# EAGLE design Threeno DB28 Tx Rev1 (EAGLE 9.6.2)
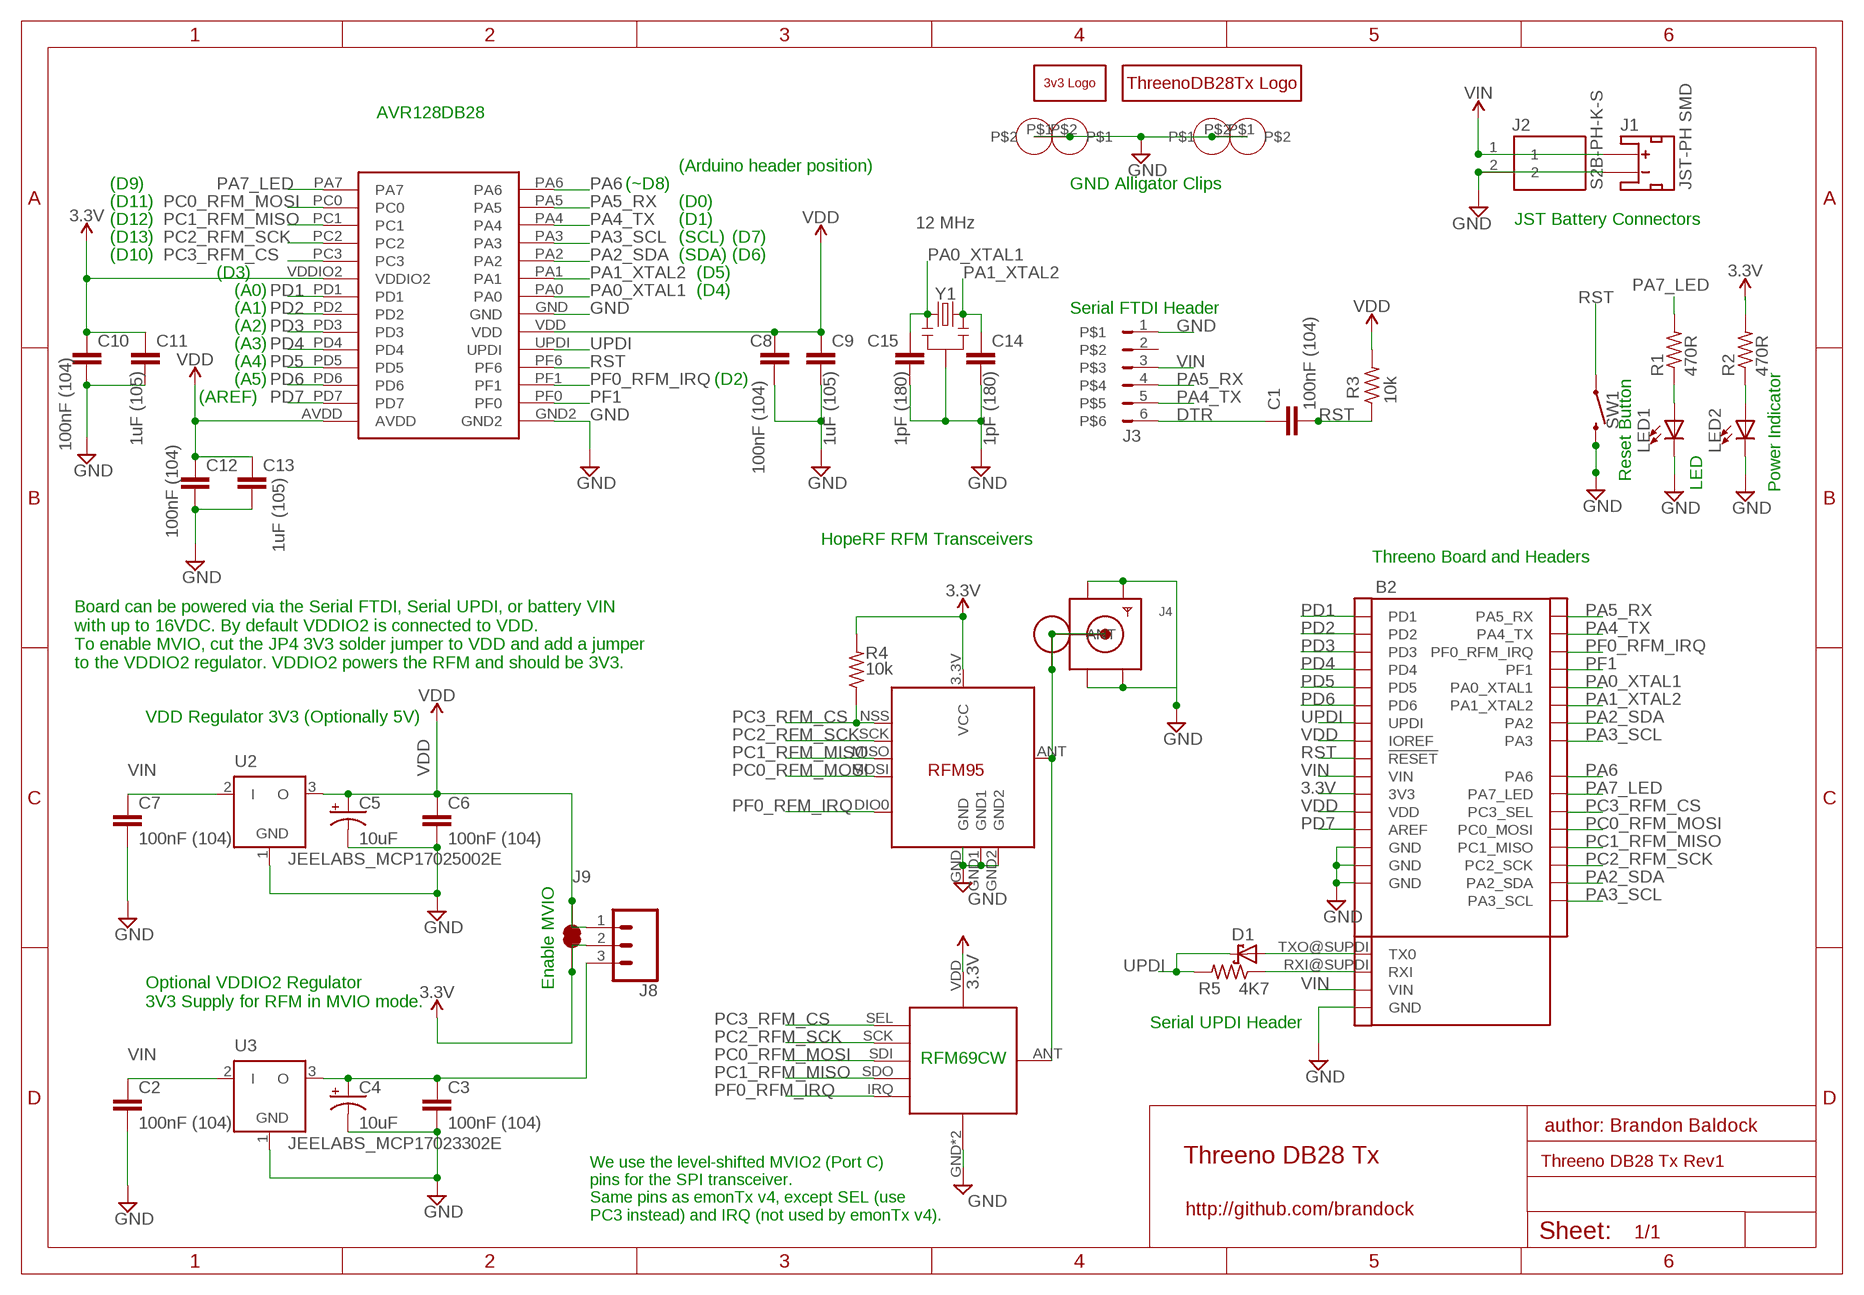
[diagram p0: schematic, sheet 1]

## Parts
B1  3VTHREENO_BOTTOM_SILK  [3VTHREENO_BOTTOM_SILK]
B2  THREENO_DB28_TX_BOARD_V1.1  [THREENO_DB28_TX_BOARD_V1.1]
B3  THREENO_DB28_TX_LOGO  [THREENO_DB28_TX_LOGO]
C1  100nF (104)  C-EU025-024X044-NO_MIDDLE_SILK  [C025-024X044-NO-MIDDLE-SILK]
C2  100nF (104)  C-EU025-024X044-NO_MIDDLE_SILK  [C025-024X044-NO-MIDDLE-SILK]
C3  100nF (104)  C-EU025-024X044-NO_MIDDLE_SILK  [C025-024X044-NO-MIDDLE-SILK]
C4  10uF  CPOL-USE1.8-4  [E1,8-4]
C5  10uF  CPOL-USE1.8-4  [E1,8-4]
C6  100nF (104)  C-EU025-024X044-NO_MIDDLE_SILK  [C025-024X044-NO-MIDDLE-SILK]
C7  100nF (104)  C-EU025-024X044-NO_MIDDLE_SILK  [C025-024X044-NO-MIDDLE-SILK]
C8  100nF (104)  C-EU025-024X044-NO_MIDDLE_SILK  [C025-024X044-NO-MIDDLE-SILK]
C9  1uF (105)  C-EU025-024X044-NO_MIDDLE_SILK  [C025-024X044-NO-MIDDLE-SILK]
C10  100nF (104)  C-EU025-024X044-NO_MIDDLE_SILK  [C025-024X044-NO-MIDDLE-SILK]
C11  1uF (105)  C-EU025-024X044-NO_MIDDLE_SILK  [C025-024X044-NO-MIDDLE-SILK]
C12  100nF (104)  C-EU025-024X044-NO_MIDDLE_SILK  [C025-024X044-NO-MIDDLE-SILK]
C13  1uF (105)  C-EU025-024X044-NO_MIDDLE_SILK  [C025-024X044-NO-MIDDLE-SILK]
C14  1pF (180)  C-EU025-024X044-NO_MIDDLE_SILK  [C025-024X044-NO-MIDDLE-SILK]
C15  1pF (180)  C-EU025-024X044-NO_MIDDLE_SILK  [C025-024X044-NO-MIDDLE-SILK]
D1  DIODE SCHOTTKY 30V 200MA DO35  SCHOTTKY-DIODEDO41-7  [DO41-7]
J1  JST_2MM_MALE  [JST-2-SMD]
J2  S2B-PH-K-S  [S2BPHKS]
J3  FTDI  [FTDI_ROUND_HEADER_SILK]
J4  SMACONNECTOR_EDGE  [SMA_EDGELAUNCH]
J5  RFM12B_ANTENNA  [RFM12B-ANTENNA]
J6  ALLIGATORCLIP-WIRELOOP  [ALLIGATORCLIP-WIRELOOP]
J7  ALLIGATORCLIP-WIRELOOP  [ALLIGATORCLIP-WIRELOOP]
J8  455-1750-1-ND  CONN_03  [1X03]
J9  JUMPER-SMT_2_NC_TRACE_24_MIL_NO-SILK  [SMT-JUMPER_2_NC_TRACE_NO-SILK_24_MIL]
LED1  LED-BRANDOCK3MM  [LED3MM-BRANDOCK]
LED2  LED-BRANDOCK3MM  [LED3MM-BRANDOCK]
R1  470R  R-US_0204/7  [0204/7]
R2  470R  R-US_0204/7  [0204/7]
R3  10k  R-US_0204/7  [0204/7]
R4  10k  R-US_0204/7  [0204/7]
R5  4K7  R-US_0204/7  [0204/7]
RF1  RFM12B_MINPADS  [RFM12B-MINPADS]
RF2  RFM95LONGER  [RFM95_LONGER]
SW1  MOMENTARY-SWITCH-SPST-PTH-6.0MM  [TACTILE_SWITCH_PTH_6.0MM]
U1  AVR128DB28  [DIL28-3]
U2  JEELABS_MCP17025002E  [JEELABS_TO92]
U3  JEELABS_MCP17023302E  [JEELABS_TO92]
Y1  12 MHz  CRYSTAL-OR-RESONATOR  [HC49US-OR-RESONATOR]

## Nets
3.3V: B2.3.3V(3V3) C10.1 C11.1 J8.2 J9.2 R2.2 R4.2 RF1.VDD RF2.3.3V(VCC) U1.VDDIO2
DTR: C1.1 J3.6
GND: B2.GND@1(GND) B2.GND@2(GND) B2.GND@3(GND) B2.GND@SUPDI(GND) C2.2 C3.2 C4.- C5.- C6.2 C7.2 C8.2 C9.2 C10.2 C11.2 C12.2 C13.2 C14.2 C15.2 J1.1(-) J2.2 J3.1 J4.GND@1(GND4) J4.GND@2(GND3) J4.GND@3(GND2) J4.GND@4(GND1) J6.P$1 J6.P$2 J7.P$1 J7.P$2 LED1.K(C) LED2.K(C) RF1.GND RF1.GND2(GND) RF2.GND RF2.GND1 RF2.GND2 SW1.3 U1.GND U1.GND2 U2.1(GND) U3.1(GND) Y1.2
N$2: LED2.A R2.1
N$3: J4.P(ANT) J5.P$1 RF1.ANT RF2.ANT
N$5: B2.RXI@SUPDI(RXI) R5.1
N$6: B2.TXO@SUPDI(TX0) D1.A
N$7: C3.1 C4.+ J8.3 U3.3(O)
N$14: LED1.A R1.1
PA0_XTAL1: B2.PA0(PA0_XTAL1) C15.1 U1.PA0 Y1.1
PA1_XTAL2: B2.PA1(PA1_XTAL2) C14.1 U1.PA1 Y1.3
PA2_SDA: B2.PA2 B2.PA2|SDA(PA2_SDA) U1.PA2
PA3_SCL: B2.PA3 B2.PA3|SCL(PA3_SCL) U1.PA3
PA4_TX: B2.PA4|TX(PA4_TX) J3.5 U1.PA4
PA5_RX: B2.PA5|RX(PA5_RX) J3.4 U1.PA5
PA6: B2.PA6 U1.PA6
PA7_LED: B2.PA7(PA7_LED) R1.2 U1.PA7
PC0_RFM_MOSI: B2.PC0(PC0_MOSI) RF1.SDI(SDI/MOSI) RF2.MOSI U1.PC0
PC1_RFM_MISO: B2.PC1(PC1_MISO) RF1.SDO(SDO/MISO) RF2.MISO U1.PC1
PC2_RFM_SCK: B2.PC2(PC2_SCK) RF1.SCK RF2.SCK U1.PC2
PC3_RFM_CS: B2.PC3(PC3_SEL) R4.1 RF1.SEL RF2.NSS(SEL) U1.PC3
PD1: B2.PD1|A0(PD1) U1.PD1
PD2: B2.PD2|A1(PD2) U1.PD2
PD3: B2.PD3|A2(PD3) U1.PD3
PD4: B2.PD4|A3(PD4) U1.PD4
PD5: B2.PD5|A4(PD5) U1.PD5
PD6: B2.PD6|A5(PD6) U1.PD6
PD7: B2.PD7(AREF) U1.PD7
PF0_RFM_IRQ: B2.PF0(PF0_RFM_IRQ) RF1.IRQ RF2.DIO0 U1.PF1
PF1: B2.PF1 U1.PF0
RST: B2.RESET@1(!RESET!) C1.2 R3.1 SW1.1 U1.PF6
UPDI: B2.NC(UPDI) D1.C R5.2 U1.UPDI
VDD: B2.VDD B2.VDD|IOREF(IOREF) C5.+ C6.1 C8.1 C9.1 C12.1 C13.1 J8.1 J9.1 R3.2 U1.AVDD U1.VDD U2.3(O)
VIN: B2.VIN B2.VIN@SUPDI(VIN) C2.1 C7.1 J1.2(+) J2.1 J3.3 U2.2(I) U3.2(I)
Unconnected: J1.NC1(PAD1) J1.NC2(PAD2) J3.2

## Notes on the sheet
- AVR128DB28
- (Arduino header position)
- (D9) | (~D8) | GND Alligator Clips | S2B-PH-K-S | JST-PH SMD
- (D11) | (D0) | Optional Crystal
- (D12) | (D1) | JST Battery Connectors
- (D13) | (SCL) | (D7)
- (D10) | (SDA) | (D6)
- (D3) | (D5)
- (A0) | (D4)
- (A1) | Serial FTDI Header
- (A2)
- (A3)
- (A4)
- (A5) | (D2)
- (AREF)
- Auto-reset cap is used instead of filtering
  cap from 4.3 of AVR128DB datasheet.
- Reset Button
- LED | Power Indicator
- HopeRF RFM Transceivers
- Threeno Board and Headers
- Board can be powered via the Serial FTDI, Serial UPDI, or battery VIN
  with up to 16VDC. By default VDDIO2 is connected to VDD.
  To enable MVIO, cut the JP4 3V3 solder jumper to VDD and add a jumper
  to the VDDIO2 regulator. VDDIO2 powers the RFM and should be 3V3.
- VDD Regulator 3V3 (Optionally 5V)
- Enable MVIO
- Optional VDDIO2 Regulator
  3V3 Supply for RFM in MVIO mode.
- Serial UPDI Header
- RFM69CW
- author: Brandon Baldock
- Threeno DB28 Tx
- http://github.com/brandock
- We use the level-shifted MVIO2 (Port C)
  pins for the SPI transceiver.
  Same pins as emonTx v4, except SEL (use
  PC3 instead) and IRQ (not used by emonTx v4).

## Library data of the parts
B1 = 3VThreeno:3VTHREENO_BOTTOM_SILK: Arduino R3 Footprint with SPI header Arduino Uno R3 Compatible Footprint. Matches PCB size of the original board. SparkFun Products: SAMD21 Dev Breakout <https://www.sparkfun.com/products/13672> RedBoard <https://www.sparkfun.com/products/12757> R3 Stackable Headers <https://www.sparkfun.com/products/11417>
B2 = 3VThreeno:THREENO_DB28_TX_BOARD_V1.1: Arduino R3 Footprint with SPI header Arduino Uno R3 Compatible Footprint. Matches PCB size of the original board. SparkFun Products: SAMD21 Dev Breakout <https://www.sparkfun.com/products/13672> RedBoard <https://www.sparkfun.com/products/12757> R3 Stackable Headers <https://www.sparkfun.com/products/11417>
B3 = 3VThreeno:THREENO_DB28_TX_LOGO: Arduino R3 Footprint with SPI header Arduino Uno R3 Compatible Footprint. Matches PCB size of the original board. SparkFun Products: SAMD21 Dev Breakout <https://www.sparkfun.com/products/13672> RedBoard <https://www.sparkfun.com/products/12757> R3 Stackable Headers <https://www.sparkfun.com/products/11417>
C1-C3 C6-C15 = rcl-brandock:C-EU: CAPACITOR, European symbol
C4 C5 = rcl:CPOL-US: POLARIZED CAPACITOR, American symbol; SPICEPREFIX: C
D1 = adafruit:SCHOTTKY-DIODE: Schottky Diode
J1 = SparkFun-Connectors:JST_2MM_MALE: JST 2MM MALE RA CONNECTOR Two pin, compact surface mount connector. Commonly used as a battery input connection point. We really like the solid locking feeling and high current rating on these small connectors. We use these all the time as battery connectors. Mates to single-cell LiPo batteries. Here is the connector we sell at SparkFun: JST Right Angle Connector - White <https://www.sparkfun.com/products/8612> (PRT-08612) Datasheet <http://www.sparkfun.com/datasheets/Prototyping/Connectors/JST-Horizontal.pdf> It was used on these SparkFun products: SparkFun MOSFET Power Controller <https://www.sparkfun.com/products/11214> (PRT-11214) SparkFun Battery Babysitter - LiPo Battery Manager <https://www.sparkfun.com/products/13777> (PRT-13777) And many, many others that required a lipo battery connection.; PROD_ID: CONN-11443; SF_ID: PRT-08612
J2 = JST PH Thru Hole S2B-PH-K-S:S2B-PH-K-S: CONN HEADER R/A 2POS 2MM Source: Datasheet <https://media.digikey.com/pdf/Data Sheets/JST PDFs/PH Series.pdf>; DESCRIPTION: CONN HEADER R/A 2POS 2MM; HEIGHT: 4.8mm; MANUFACTURER_NAME: JST (JAPAN SOLDERLESS TERMINALS); MANUFACTURER_PART_NUMBER: S2B-PH-K-S
J3 = FTDI:FTDI: JUMPER
J4 = adafruit:SMACONNECTOR: SMA Connector 90° DIP SMA Connector, 50 Ohm (4UConnector: 07259)
J5 = LowPowerLab:RFM12B_ANTENNA
J6 J7 = Alligator Clip:ALLIGATORCLIP-WIRELOOP
J8 = SparkFun-Connectors:CONN_03: Multi connection point. Often used as Generic Header-pin footprint for 0.1 inch spaced/style header connections On any of the 0.1 inch spaced packages, you can populate with these: Break Away Headers - Straight <https://www.sparkfun.com/products/116> (PRT-00116) Break Away Male Headers - Right Angle <https://www.sparkfun.com/products/553> (PRT-00553) Female Headers <https://www.sparkfun.com/products/115> (PRT-00115) Break Away Headers - Machine Pin <https://www.sparkfun.com/products/117> (PRT-00117) Break Away Female Headers - Swiss Machine Pin <https://www.sparkfun.com/products/743> (PRT-00743) Stackable Header - 3 Pin (Female, 0.1") <https://www.sparkfun.com/products/13875> (PRT-13875) For SCREWTERMINALS and SPRING TERMINALS visit here: Screw Terimnals on SparkFun.com <https://www.sparkfun.com/search/results?term=Screw+Terminals> (5mm/3.5mm/2.54mm spacing) This device is also useful as a general connection point to wire up your design to another part of your project. Our various solder wires solder well into these plated through hole pads. Hook-Up Wire - Assortment (Stranded, 22 AWG) <https://www.sparkfun.com/products/11375> (PRT-11375) Hook-Up Wire - Assortment (Solid Core, 22 AWG) <https://www.sparkfun.com/products/11367> (PRT-11367) View the entire wire category on our website here <https://www.sparkfun.com/categories/141> Special notes: Molex polarized connector foot print use with SKU : PRT-08232 with associated crimp pins and housings.; PROD_ID: XXX-00000
J9 = SparkFun-Jumpers:JUMPER-SMT_2_NC_TRACE_24_MIL: Normally closed trace jumper This jumper has a trace between two pads so it's normally closed (NC). Use a razor knife to open the connection. For best results follow the IPC guidelines for cutting traces: Cutout at least 0.063 mm (0.005 in). Remove all loose material to clean up the cut area. Seal the cut with an approved epoxy. Reapply solder to reclose the connection.
LED1 LED2 = adafruit:LED-BRANDOCK: LED OSRAM: - CHIPLED LG R971, LG N971, LY N971, LG Q971, LY Q971, LO R971, LY R971 LH N974, LH R974 LS Q976, LO Q976, LY Q976 LO Q996 - Hyper CHIPLED LW Q18S LB Q993, LB Q99A, LB R99A - SideLED LS A670, LO A670, LY A670, LG A670, LP A670 LB A673, LV A673, LT A673, LW A673 LH A674 LY A675 LS A676, LA A676, LO A676, LY A676, LW A676 LS A679, LY A679, LG A679 - Hyper Micro SIDELED® LS Y876, LA Y876, LO Y876, LY Y876 LT Y87S - SmartLED LW L88C, LW L88S LB L89C, LB L89S, LG L890 LS L89K, LO L89K, LY L89K LS L896, LA L896, LO L896, LY L896 - TOPLED LS T670, LO T670, LY T670, LG T670, LP T670 LSG T670, LSP T670, LSY T670, LOP T670, LYG T670 LG T671, LOG T671, LSG T671 LB T673, LV T673, LT T673, LW T673 LH T674 LS T676, LA T676, LO T676, LY T676, LB T676, LH T676, LSB T676, LW T676 LB T67C, LV T67C, LT T67C, LS T67K, LO T67K, LY T67K, LW E67C LS E67B, LA E67B, LO E67B, LY E67B, LB E67C, LV E67C, LT E67C LW T67C LS T679, LY T679, LG T679 LS T770, LO T770, LY T770, LG T770, LP T770 LB T773, LV T773, LT T773, LW T773 LH T774 LS E675, LA E675, LY E675, LS T675 LS T776, LA T776, LO T776, LY T776, LB T776 LHGB T686 LT T68C, LB T68C - Hyper Mini TOPLED® LB M676 - Mini TOPLED Santana® LG M470 LS M47K, LO M47K, LY M47K Source: http://www.osram.convergy.de/
R1-R5 = rcl:R-US_: RESISTOR, American symbol; SPICEPREFIX: R
RF1 = RFM_MiniPads:RFM12B_MINPADS
RF2 = RFM_MiniPads:RFM95
SW1 = SparkFun-Switches:MOMENTARY-SWITCH-SPST: Momentary Switch (Pushbutton) - SPST Normally-open (NO) SPST momentary switches (buttons, pushbuttons). Variants PTH-12MM - 12mm square, through-hole Momentary Pushbutton Switch - 12mm Square <https://www.sparkfun.com/products/9190> (COM-09190) PTH-6.0MM, PTH-6.0MM-KIT - 6.0mm square, through-hole Mini Pushbutton Switch <https://www.sparkfun.com/products/97> (COM-00097) KIT package intended for soldering kit's - only one side of pads' copper is exposed. PTH-RIGHT-ANGLE-KIT - Right-angle, through-hole Right Angle Tactile Button <https://www.sparkfun.com/products/10791> - Used on SparkFun BigTime Watch Kit <https://www.sparkfun.com/products/11734> SMD-12MM - 12mm square, surface-mount Tactile Button - SMD (12mm) <https://www.sparkfun.com/products/12993> (COM-12993) Used on SparkFun PicoBoard <https://www.sparkfun.com/products/11888> SMD-4.5MM - 4.5mm Square Trackball Switch Used on SparkFun Blackberry Trackballer Breakout <https://www.sparkfun.com/products/13169> SMD-4.6MMX2.8MM - 4.60mm x 2.80mm, surface mount Used on SparkFun SAMD21 Mini Breakout <https://www.sparkfun.com/products/13664> SMD-5.2MM, SMD-5.2-REDUNDANT - 5.2mm square, surface-mount Mini Pushbutton Switch - SMD <https://www.sparkfun.com/products/8720> (COM-08720) Used on Arduino Pro Mini <https://www.sparkfun.com/products/11114> REDUNDANT package connects both switch circuits together SMD-6.0X3.5MM - 6.0 x 3.5mm, surface mount Momentary Reset Switch SMD <https://www.sparkfun.com/products/8229> (COM-08229) SMD-6.2MM-TALL - 6.2mm square, surface mount Tactile Button - SMD (6mm) <https://www.sparkfun.com/products/12992> Used on SparkFun Digital Sandbox <https://www.sparkfun.com/products/12651> SMD-RIGHT-ANGLE - Right-angle, surface mount Used on SparkFun Block for Intel® Edison - Arduino <https://www.sparkfun.com/products/13036>; PROD_ID: SWCH-08441; SF_SKU: COM-00097
U1 = AVR-DB:AVR128DB28
U2 U3 = JeeLib:JEELABS_MCP1702: 200 mA, Low Power Low Dropout Voltage Regulator
Y1 = SparkFun-Clocks-Brandock:CRYSTAL-OR-RESONATOR: Crystals (Generic) These are passive quartz crystals, which can be used as a clock source for a microcontroller. Crystal's are two-terminal devices. They require external "load" capacitors to generate an oscillating signal.

## Net classes
1 power: width 0.381 mm, clearance 0.254 mm

## Board
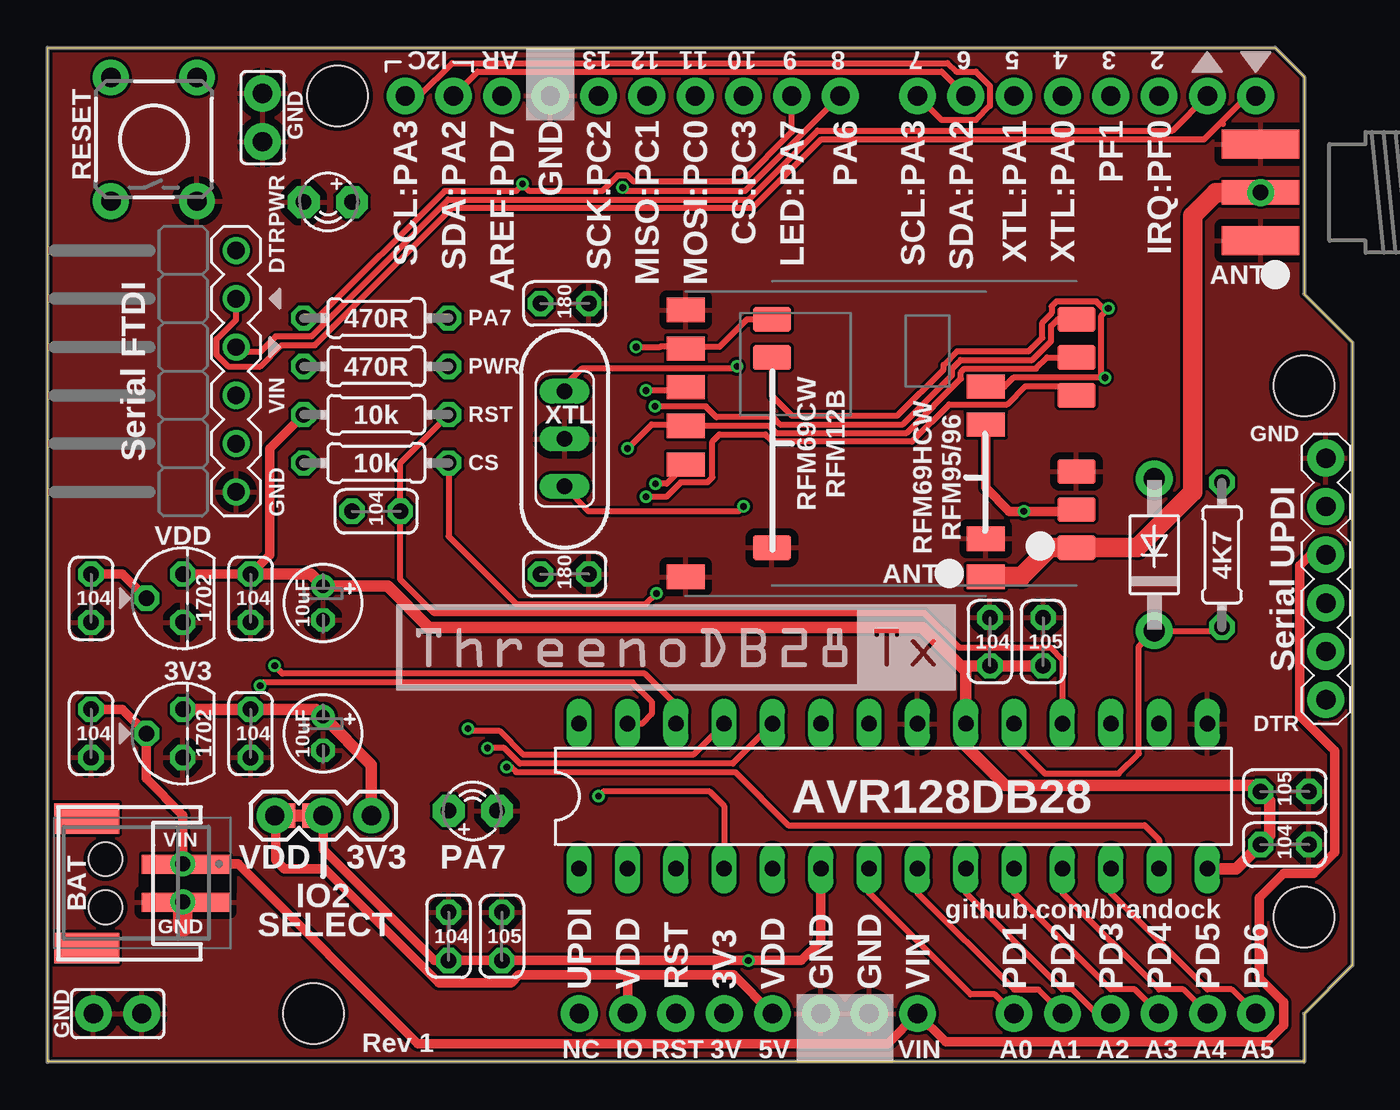
[diagram p1: board, top side]
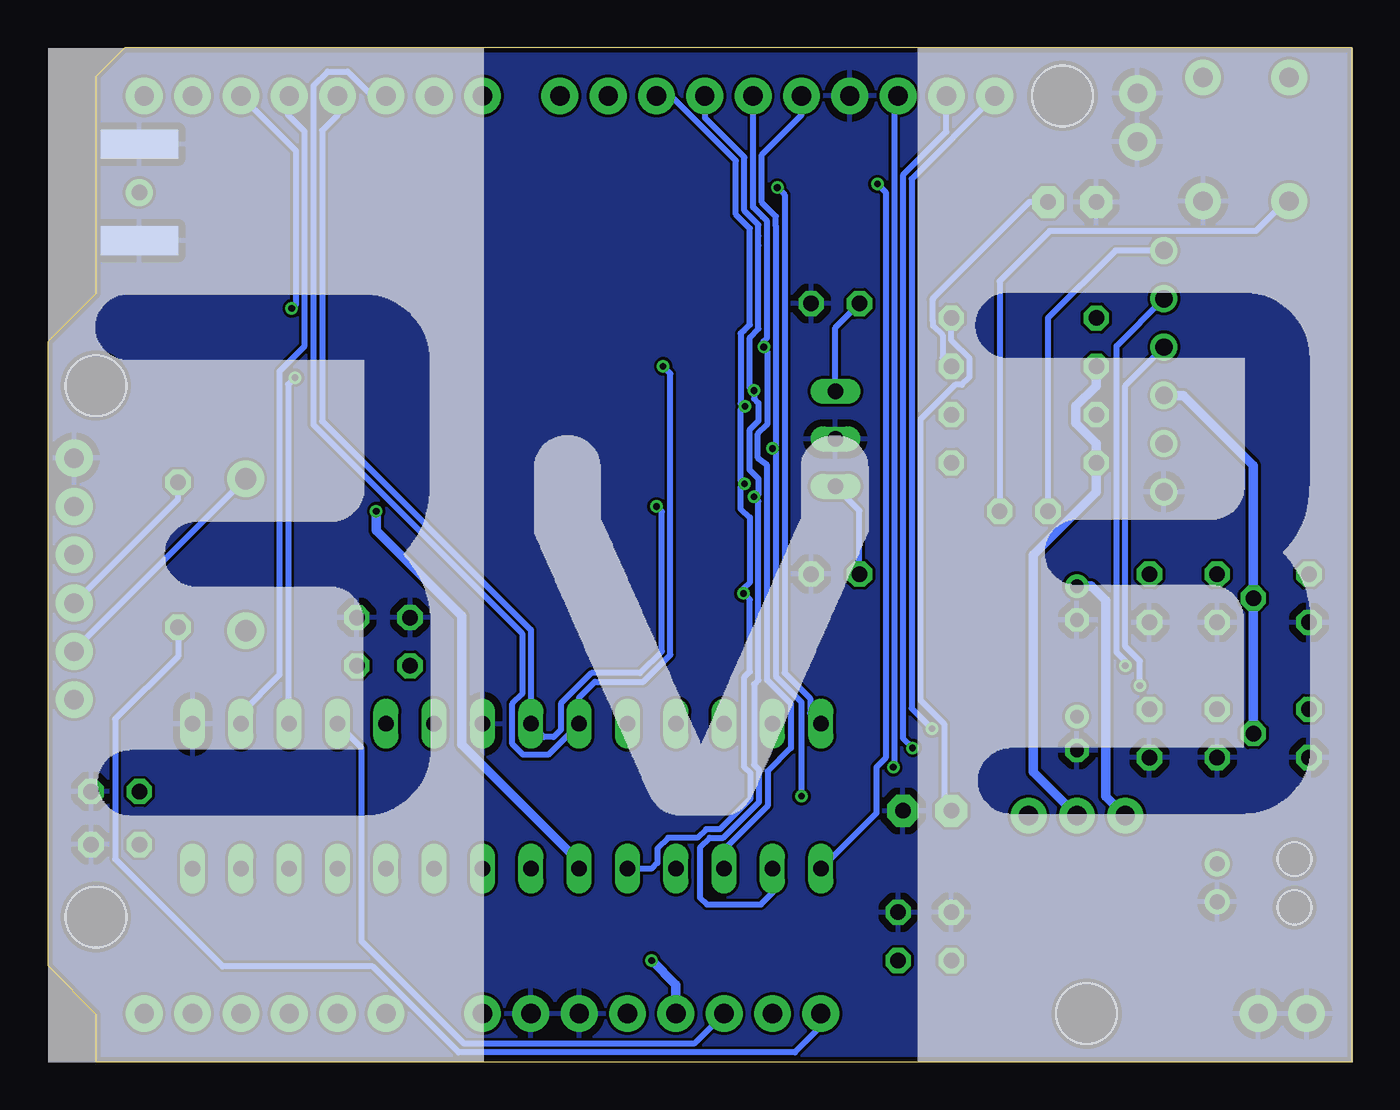
[diagram p2: board, bottom side, seen from below]

Size 68.58 x 53.34 mm. Coordinates in mm from the lower left corner, seen from the top.
Outline: 64.52,53.34 66.04,51.82 66.04,40.39 68.58,37.85 68.58,5.08 66.04,2.54 66.04,0 0,0 0,53.34 64.52,53.34
Copper layers (1*16): Top 0.035mm / dielectric 1.5mm / Bottom 0.035mm
Design rules "ITEADstudio_DRC *": minimum track width 6mil, minimum drill 12mil, track to track 6mil, track to pad 6mil, pad to pad 6mil, via to via 6mil, smd to smd 0mil, copper to edge 10mil, drill to drill 10mil, minimum pad ring 10mil, minimum via ring 6mil, stop-mask expansion 2mil, vias tented up to drill 100mil, thermal gap 15mil
Holes 1.78 mm at 3.05,10.67 3.05,8.13
tRestrict: area 4.8,8.9 to 9.9,9.9

### Footprints (pad centres in the part's own frame; a part is rotated, then mirrored left to right if it is on the bottom)
THREENO_DB28_TX_BOARD_V1.1 = drill 1.016 pad 1.93: 3.3V 2.54,-24.13; CTS@SUPDI 34.163,2.54; DTR@SUPDI 34.163,-7.62; GND@1 7.62,-24.13; GND@2 10.16,-24.13; GND@3 -6.604,24.13; GND@SUPDI 34.163,5.08; NC -5.08,-24.13; PA0 20.32,24.13; PA1 17.78,24.13; PA2 15.24,24.13; PA2|SDA -11.684,24.13; PA3 12.7,24.13; PA3|SCL -14.224,24.13; PA4|TX 30.48,24.13; PA5|RX 27.94,24.13; PA6 8.636,24.13; PA7 6.096,24.13; PC0 1.016,24.13; PC1 -1.524,24.13; PC2 -4.064,24.13; PC3 3.556,24.13; PD1|A0 17.78,-24.13; PD2|A1 20.32,-24.13; PD3|A2 22.86,-24.13; PD4|A3 25.4,-24.13; PD5|A4 27.94,-24.13; PD6|A5 30.48,-24.13; PD7 -9.144,24.13; PF0 25.4,24.13; PF1 22.86,24.13; RESET@1 0,-24.13; RXI@SUPDI 34.163,-2.54; TXO@SUPDI 34.163,-5.08; VDD 5.08,-24.13; VDD|IOREF -2.54,-24.13; VIN 12.7,-24.13; VIN@SUPDI 34.163,0 | hole 3.175: -17.78,24.13; 33.02,8.89; 33.02,-19.05; -19.05,-24.13
C025-024X044-NO-MIDDLE-SILK = drill 0.813 octagon: 1 -1.27,0; 2 1.27,0
E1,8-4 = drill 0.711 pad 1.168: + -0.889,0 | drill 0.711 pad 1.168 octagon: - 0.889,0
DO41-7 = drill 1.118 pad 1.93: A 4,0; C -4,0
JST-2-SMD = smd 1 x 4.6: 1 -1,-3.7; 2 1,-3.7 | smd 1.6 x 3.4: NC1 -3.4,1.5; NC2 3.4,1.5
S2BPHKS = drill 0.8 pad 1.3: 1 0,0; 2 -2,0
FTDI_ROUND_HEADER_SILK = drill 0.914: 1 -2.54,-1.27; 2 0,-1.27; 3 2.54,-1.27; 4 5.08,-1.27; 5 7.62,-1.27; 6 10.16,-1.27
SMA_EDGELAUNCH = smd 4.064 x 1.524: GND@1 2.032,-2.54; GND@2 2.032,2.54 | smd 4.064 x 1.524 bottom: GND@3 2.032,2.54; GND@4 2.032,-2.54 | smd 4.064 x 1.27: P 2.032,0
RFM12B-ANTENNA = drill 0.8 pad 1.422: P$1 0,0
ALLIGATORCLIP-WIRELOOP = drill 1.016 pad 1.93: P$1 -2.54,0; P$2 0,0
1X03 = drill 1.016 pad 1.88: 1 0,0; 2 2.54,0; 3 5.08,0
SMT-JUMPER_2_NC_TRACE_NO-SILK_24_MIL = smd 0.635 x 1.27: 1 -0.508,0; 2 0.508,0
LED3MM-BRANDOCK = drill 0.813 pad 1.676 octagon: A -1.27,0; K 1.27,0
0204/7 = drill 0.813 octagon: 1 -3.81,0; 2 3.81,0
RFM12B-MINPADS = smd 2 x 1.27: ANT 8,-6; GND 8,-2; GND2 -8.002,-6.001; IRQ -8,4; SCK 8,4; SDI 8,2; SDO -8,6; SEL 8,6; VDD 8,-4
RFM95_LONGER = smd 2 x 1.27: 3.3V 7.651,1; ANT 7.651,-7; DIO0 7.651,3; GND 7.651,-5; GND1 -8.107,-7; GND2 -8.107,7.032; MISO -8.107,5; MOSI -8.107,2.968; NSS -8.107,-1.096; SCK -8.107,0.936
TACTILE_SWITCH_PTH_6.0MM = drill 1.016 pad 1.88: 1 -3.251,2.261; 2 3.251,2.261; 3 -3.251,-2.261; 4 3.251,-2.261
DIL28-3 = drill 0.813 long: AVDD -16.51,3.81; GND -1.27,-3.81; GND2 -16.51,-3.81; PA0 1.27,-3.81; PA1 3.81,-3.81; PA2 6.35,-3.81; PA3 8.89,-3.81; PA4 11.43,-3.81; PA5 13.97,-3.81; PA6 16.51,-3.81; PA7 16.51,3.81; PC0 13.97,3.81; PC1 11.43,3.81; PC2 8.89,3.81; PC3 6.35,3.81; PD1 1.27,3.81; PD2 -1.27,3.81; PD3 -3.81,3.81; PD4 -6.35,3.81; PD5 -8.89,3.81; PD6 -11.43,3.81; PD7 -13.97,3.81; PF0 -13.97,-3.81; PF1 -11.43,-3.81; PF6 -8.89,-3.81; UPDI -6.35,-3.81; VDD -3.81,-3.81; VDDIO2 3.81,3.81
JEELABS_TO92 = drill 0.813 octagon: 1 -1.27,0; 2 0,1.905; 3 1.27,0
HC49US-OR-RESONATOR = drill 0.813 long: 1 -2.5,0; 2 0,0; 3 2.5,0

### Placement (x,y rotation side)
B1  33.02,26.67 0 top
B2  33.02,26.67 0 top
B3  34.01,21.49 0 top
C1  17.27,28.96 0 top
C2  2.29,17.27 270 top
C3  10.67,17.27 270 top
C4  14.48,17.27 270 top
C5  14.48,24.13 270 top
C6  10.67,24.38 270 top
C7  2.29,24.38 270 top
C8  49.53,22.1 90 top
C9  52.32,22.1 90 top
C10  23.88,6.6 90 top
C11  21.08,6.6 90 top
C12  65.02,11.43 0 top
C13  65.02,14.22 0 top
C14  27.18,39.88 0 top
C15  27.18,25.65 0 top
D1  58.17,26.67 90 top
J1  3.56,9.4 90 top
J2  7.11,10.41 90 top
J3  8.64,32.51 90 top
J4  65.79,45.72 180 top
J5  63.75,45.72 0 top
J6  11.3,50.93 90 top
J7  2.41,2.54 180 top
J8  11.94,12.95 0 top
J9  13.21,12.95 0 top
LED1  22.35,13.21 0 top
LED2  14.73,45.21 180 top
R1  17.27,39.12 180 top
R2  17.27,36.58 180 top
R3  17.27,34.04 180 top
R4  17.27,31.5 180 top
R5  61.72,26.67 270 top
RF1  46.08,33.05 0 top
RF2  41.66,32.51 0 top
SW1  5.59,48.51 90 top
U1  44.45,13.97 180 top
U2  7.11,24.38 90 top
U3  7.11,17.27 90 top
Y1  27.18,32.77 90 top

### Tracks (layer width: path | path; a pad name or v marks a point on that pad's centre or on a via)
3.3V  (via drill 0.35)
  Top 0.508: U1.VDDIO2 40.64,6.35 39.62,5.33 v36.83,5.33 C10.1 C11.1 20.32,5.33 14.48,11.18 J8.2 J9.2 | RF2.3.3V 49.31,30.2 50.55,28.96 v51.31,28.96 53.99,28.96 RF1.VDD
  Bottom 0.508: v36.83,5.33 35.56,4.06 B2.3.3V | J8.2 16.76,15.24 16.76,26.67 13.46,29.97 R4.2 13.46,32.53 14.53,33.59 14.53,34.48 13.46,35.54 R2.2 | U1.VDDIO2 40.64,10.53 46.82,16.71 46.82,23.45 51.31,27.94 v51.31,28.96
DTR
  Bottom 0.305: J3.6 12.45,42.67 16,39.12 C1.1
GND
  Top 1.016: J1.1 7.11,8.25 7.11,7.11
  pour Top: -7.87,54.61 74.93,54.61 74.93,-1.27 -7.87,-1.27
  pour Bottom: -7.87,54.61 74.93,54.61 74.93,-1.27 -7.87,-1.27
N$2
  Bottom 0.305: LED2.A 16.97,45.21 22.08,40.11 22.05,40.08 22.05,38.96 22.05,38.72 21.54,38.21 21.54,37.03 R2.1
N$3
  Top 1.016: J4.P 61.41,45.72 60.2,44.51 60.2,29.97 57.28,27.05 RF1.ANT 52.7,27.05 51.17,25.52 49.32,25.52 RF2.ANT
N$5
  Bottom 0.305: B2.RXI@SUPDI 61.72,29.59 R5.1
N$6
  Bottom 0.305: D1.A 67.18,21.65 B2.TXO@SUPDI
N$7
  Top 0.61: U3.3 C3.1 14.1,18.54 C4.+ 17.02,15.62 J8.3
N$14
  Bottom 0.305: R1.1 21.08,37.94 20.12,36.98 20.12,36.02 20.52,35.61 20.87,35.61 22.71,33.77 22.71,19.03 21.47,17.79 21.47,13.59 LED1.A
PA0_XTAL1  (via drill 0.35)
  Top 0.305: Y1.1 28.42,28.96 36.32,28.96 v36.58,29.21
  Bottom 0.305: C15.1 25.91,29 Y1.1 | B2.PA0 53.34,49.78 54.15,48.97 54.15,33.69 43.18,22.72 U1.PA0 42.49,17.09 41.98,17.09 41.6,17.46 41.6,18.84 40,20.44 37.45,20.44 36.3,21.6 36.3,28.93 v36.58,29.21
PA1_XTAL2  (via drill 0.35)
  Top 0.305: Y1.3 27.18,35.56 28.07,36.45 36.1,36.45 v36.23,36.58
  Bottom 0.305: Y1.3 27.18,38.61 C14.1 | B2.PA1 51.54,50.8 52.81,52.07 53.87,52.07 54.61,51.33 54.61,33.51 43.64,22.53 43.64,19.35 44.14,18.84 44.14,16.72 43.58,16.15 42.27,16.15 U1.PA1 40.64,19.16 39.81,19.99 37.27,19.99 35.84,21.41 35.84,36.19 v36.23,36.58
PA2_SDA  (via drill 0.35)
  Top 0.305: B2.PA2|SDA 22.61,52.07 46.99,52.07 B2.PA2 | U1.PA2 36.02,15.7 24.82,15.7 24.01,16.51 v23.11,16.51
  Bottom 0.305: B2.PA2|SDA 21.34,48.91 23.62,46.62 23.62,17.02 v23.11,16.51
PA3_SCL  (via drill 0.35)
  Top 0.305: B2.PA3|SCL 19.54,50.8 21.27,52.53 47.29,52.53 47.75,52.07 48.79,52.07 49.53,51.33 49.53,50.27 48.79,49.53 46.99,49.53 B2.PA3 | U1.PA3 33.93,16.15 25.01,16.15 23.77,17.4 22.23,17.4 v22.1,17.53
  Bottom 0.305: B2.PA3|SCL 23.17,46.43 23.17,18.59 v22.1,17.53
PA4_TX  (via drill 0.35)
  Top 0.305: U1.PA4 33.02,18.8 31.4,20.42 12.35,20.42 v11.94,20.83 | J3.5 9.91,39.03 8.89,38.01 8.89,37.17 9.48,36.58 11.18,36.58 12.29,37.69 14.05,37.69 21.24,44.88 37.03,44.88 40.66,48.51 60.78,48.51 61.6,49.33 | 61.77,49.33 61.6,49.33 | 61.6,49.33 63.07,50.8 B2.PA4|TX
  Bottom 0.305: J3.5 12.39,37.64 12.39,21.54 11.94,21.08 v11.94,20.83
PA5_RX  (via drill 0.35)
  Top 0.305: J3.4 10.16,37.34 11.18,37.34 11.99,38.15 13.86,38.15 21.05,45.34 36.84,45.34 40.47,48.97 59.13,48.97 B2.PA5|RX | U1.PA5 31.24,17.78 31.75,18.29 31.75,18.95 30.74,19.96 11.35,19.96 v11.18,19.79
  Bottom 0.305: J3.4 11.94,35.56 11.94,21.84 11.18,21.08 v11.18,19.79
PA6  (via drill 0.35)
  Top 0.305: v30.23,45.97 30.4,45.8 36.66,45.8 B2.PA6
  Bottom 0.305: v30.23,45.97 29.85,45.6 29.85,20.47 28.62,19.24 28.5,19.12 28.5,18.34 U1.PA6
PA7_LED  (via drill 0.35)
  Top 0.305: B2.PA7 39.12,48.91 36.51,46.3 30.8,46.3 30.49,46.61 29.96,46.61 29.16,45.8 25.32,45.8 v24.96,46.16 24.96,46.12 24.64,45.8 20.86,45.8 14.18,39.12 R1.2
  Bottom 0.305: v24.96,46.16 24.54,45.74 24.54,15.98 25.02,15.5 25.02,13.08 U1.PA7
PC0_RFM_MOSI  (via drill 0.35)
  Top 0.305: 54.07,35.05 RF1.SDI 53.85,35.04 53.36,35.53 51.39,35.53 50.43,34.57 47.39,34.57 45.43,32.61 38.11,32.61 37.73,32.99 35.31,32.99 34.94,32.62 34.94,30.74 34.67,30.48 33.27,30.48 32.51,29.72 v31.45,29.72 | RF2.MOSI 33.38,35.31 v31.45,35.31
  Bottom 0.305: U1.PC0 30.48,8.9 31.1,8.28 33.93,8.28 34.29,8.64 34.29,11.28 33.78,11.79 33.06,11.79 31.19,13.65 31.19,15.38 31.45,15.63 31.45,19.86 31.22,20.08 31.22,29.49 v31.45,29.72 31.22,29.84 31.22,30.67 31.7,31.15 31.7,33.22 31.22,33.7 31.22,34.65 31.45,34.88 v31.45,35.31 31.67,35.43 31.67,38.09 31.22,38.55 31.22,42.93 31.22,43.43 31.22,44.02 31.95,44.75 31.95,47.57 34.04,49.65 B2.PC0
PC1_RFM_MISO  (via drill 0.35)
  Top 0.305: 38.08,39.39 RF1.SDO 36.76,39.04 35.31,37.59 33.63,37.59 RF2.MISO 33.45,37.61 32.2,37.61 32.18,37.59 v30.94,37.59
  Bottom 0.305: U1.PC1 33.02,11.18 30.73,13.46 30.73,15.29 29.52,16.51 29.52,18.84 30.76,20.09 30.76,31.39 31.22,31.74 31.24,31.77 31.24,33.03 30.76,33.51 30.76,37.37 v30.94,37.59 30.99,37.85 30.76,38.07 30.76,43.69 | 30.76,43.69 30.76,44.21 31,44.44 31.5,44.94 B2.PC1 | 30.76,43.69
PC2_RFM_SCK  (via drill 0.35)
  Top 0.305: v28.96,13.97 29.21,14.22 34.8,14.22 35.56,13.46 U1.PC2 | 33.78,33.45 34.04,33.45 | 33.78,33.45 RF2.SCK 37.92,33.45 38.3,33.07 45.15,33.07 48,35.93 48,36.27 48.18,36.45 51.95,36.45 52.54,37.04 RF1.SCK | v30.48,32.26 31.75,33.53 33.7,33.53 33.78,33.45
  Bottom 0.305: B2.PC2 28.96,49.78 31.04,47.7 31.04,45.19 30.3,44.45 30.3,43.94 30.3,32.43 v30.48,32.26 30.3,32.08 30.3,20.28 28.96,18.93 v28.96,13.97
PC3_RFM_CS  (via drill 0.35)
  Top 0.305: 54.07,39.04 RF1.SEL | 53.57,39.04 RF1.SEL | RF1.SEL 53.09,39.04 52.74,38.7 52.74,37.89 51.76,36.91 47.99,36.91 47.54,36.46 47.54,36.12 44.96,33.53 38.49,33.53 38.11,33.91 35.16,33.91 34.59,34.47 v31.93,34.47 | 33.34,31.63 RF2.NSS 32.54,30.4 v31.95,30.4 | v32,24.64 31.45,24.08 24.64,24.08 21.08,27.63 R4.1
  Bottom 0.305: B2.PC3 35.83,50.8 32.41,47.38 32.41,44.57 31.67,43.83 31.67,38.76 31.98,38.45 32.11,38.35 32.11,38.32 32.16,38.3 32.16,34.64 v31.93,34.47 32.16,34.29 32.16,30.57 v31.95,30.4 32.16,30.22 32.16,29.08 31.67,28.63 31.67,25.22 32,24.89 v32,24.64 31.67,24.31 31.67,20.52 31.95,20.25 31.95,15.49 31.65,15.19 31.65,13.84 33.25,12.24 33.97,12.24 34.43,11.79 35.96,11.79 36.52,11.22 36.52,10.46 36.83,10.16 U1.PC3
PD1
  Top 0.305: U1.PD1 43.18,8.89 48.51,3.56 49.78,3.56 B2.PD1|A0
PD2
  Top 0.305: U1.PD2 45.72,8.89 50.8,3.81 52.07,3.81 B2.PD2|A1
PD3
  Top 0.305: U1.PD3 48.26,8.89 53.34,3.81 53.87,3.81 55.14,2.54 B2.PD3|A2
PD4
  Top 0.305: U1.PD4 50.8,8.89 55.88,3.81 57.15,3.81 B2.PD4|A3
PD5
  Top 0.305: U1.PD5 53.34,8.89 58.42,3.81 59.69,3.81 B2.PD5|A4
PD6
  Top 0.305: U1.PD6 55.88,8.89 60.96,3.81 62.23,3.81 B2.PD6|A5
PD7  (via drill 0.35)
  Top 0.305: U1.PD7 58.42,11.68 57.66,12.45 38.92,12.45 36.13,15.24 24.63,15.24 24.38,15.49 v24.13,15.49
  Bottom 0.305: B2.PD7 24.08,50.6 24.08,15.55 v24.13,15.49
PF0_RFM_IRQ  (via drill 0.35)
  Top 0.305: 38.08,36.4 RF1.IRQ 38.08,35.03 39.12,33.98 44.65,33.98 47.09,36.42 47.09,36.65 47.8,37.37 51.57,37.37 52.28,38.08 52.28,38.89 52.77,39.38 52.77,39.73 53.02,39.98 55.13,39.98 55.49,39.62 v55.75,39.62 55.38,39.25 55.38,36.17 v55.57,35.98 50.77,35.98 50.29,35.51 RF2.DIO0
  Bottom 0.305: v55.57,35.98 55.93,35.62 55.93,17.83 U1.PF1 | B2.PF0 55.52,47.9 55.52,39.84 55.74,39.62 v55.75,39.62
PF1
  Bottom 0.305: B2.PF1 55.93,50.75 55.93,49.78 55.07,48.92 55.07,37.64 56.39,36.32 56.39,20.37 58.42,18.29 U1.PF0
RST
  Top 0.305: R3.1 18.54,31.5 C1.2 18.54,25.37 20.29,23.62 46.07,23.62 47.9,21.79 52.72,21.79 53.34,21.18 U1.PF6
  Bottom 0.305: SW1.1 3.42,45.35 5.08,43.69 15.91,43.69 18.54,41.06 C1.2 | B2.RESET@1 34.59,0.96 46.68,0.96 52.07,6.35 52.07,16.51 U1.PF6
UPDI
  Top 0.305: U1.UPDI 50.8,16.77 52.41,15.16 56.3,15.16 57.35,16.21 57.35,21.86 D1.C 61.53,22.67 R5.2
  Bottom 0.305: B2.NC 27.94,1.87 29.3,0.51 46.97,0.51 51.49,5.03 59.38,5.03 65.02,10.67 65.02,18.03 61.72,21.34 R5.2
VDD
  Top 0.508: 30.48,4.57 36.07,4.57 B2.VDD | J9.1 11.99,12.95 | 11.99,12.95 J8.1 | 30.48,4.57 24.77,4.57 24.36,4.17 20.55,4.17 14.56,10.16 12.45,10.16 11.99,10.62 11.99,12.95 | B2.VDD|IOREF 30.48,4.57 | R3.2 11.68,32.26 11.68,26.67 C6.1 U2.3
  Top 0.61: C6.1 13.84,25.65 C5.+ 17.88,25.02 20.04,22.86 45.97,22.86 48.01,20.83 | U1.AVDD 62.48,10.16 C12.1 64.24,11.91 64.24,13.74 C13.1 63.43,14.55 50.34,14.55 48.26,16.63 U1.VDD 48.26,20.57 48.01,20.83 | C9.1 C8.1 48.01,20.83
  Bottom 0.508: J8.1 12.95,13.97 12.95,24.26 13.72,25.02 C5.+
VIN
  Top 0.508: J2.1 7.11,12.97 5.18,14.91 5.18,17.25 U3.2 3.94,18.54 C2.1 | J1.2 7.13,10.4 J2.1 | J2.1 10.01,10.41 19.46,0.96 44.14,0.96 B2.VIN 47.19,1.07 64.11,1.07 64.97,1.93 64.97,3.15 63.69,4.43 63.69,8.64 64.96,9.91 66.55,9.91 67.65,11.01 67.65,16.34 65.81,18.19 65.81,26.11 66.37,26.67 B2.VIN@SUPDI | C7.1 3.94,25.65 U2.2
  Bottom 0.508: J3.3 8.89,35.05 5.21,31.37 U2.2 U3.2

### Text on the board
tPlace: I2C | AR | 13 | 12 | 11 | 10 | 9 | 8 | 7 | 6 | 5 | 4 | 3 | 2 | GND | RESET | PWR | DTR | ANT | 180 | 470R | PA7 | Serial FTDI | 470R | PWR | VIN | 10k | RST | XTL | RFM69CW / RFM12B | GND | 10k | CS | RFM69HCW / RFM95/96 | GND | 104 | VDD | 4K7 | 180 | ANT | Serial UPDI | 104 | 1702 | 104 | 10uF | 104 | 105 | 3V3 | DTR | 104 | 1702 | 104 | 10uF | 105 | AVR128DB28 | VIN | VDD | 3V3 | PA7 | 104 | BAT | IO2 | SELECT | GND | 104 | 105 | GND | NC | IO | RST | 3V | 5V | VIN | A0 | A1 | A2 | A3 | A4 | A5
tNames: github.com/brandock | Rev 1